# EAGLE schematic GasSensorCentral_v3.0 (EAGLE 7.4.0)
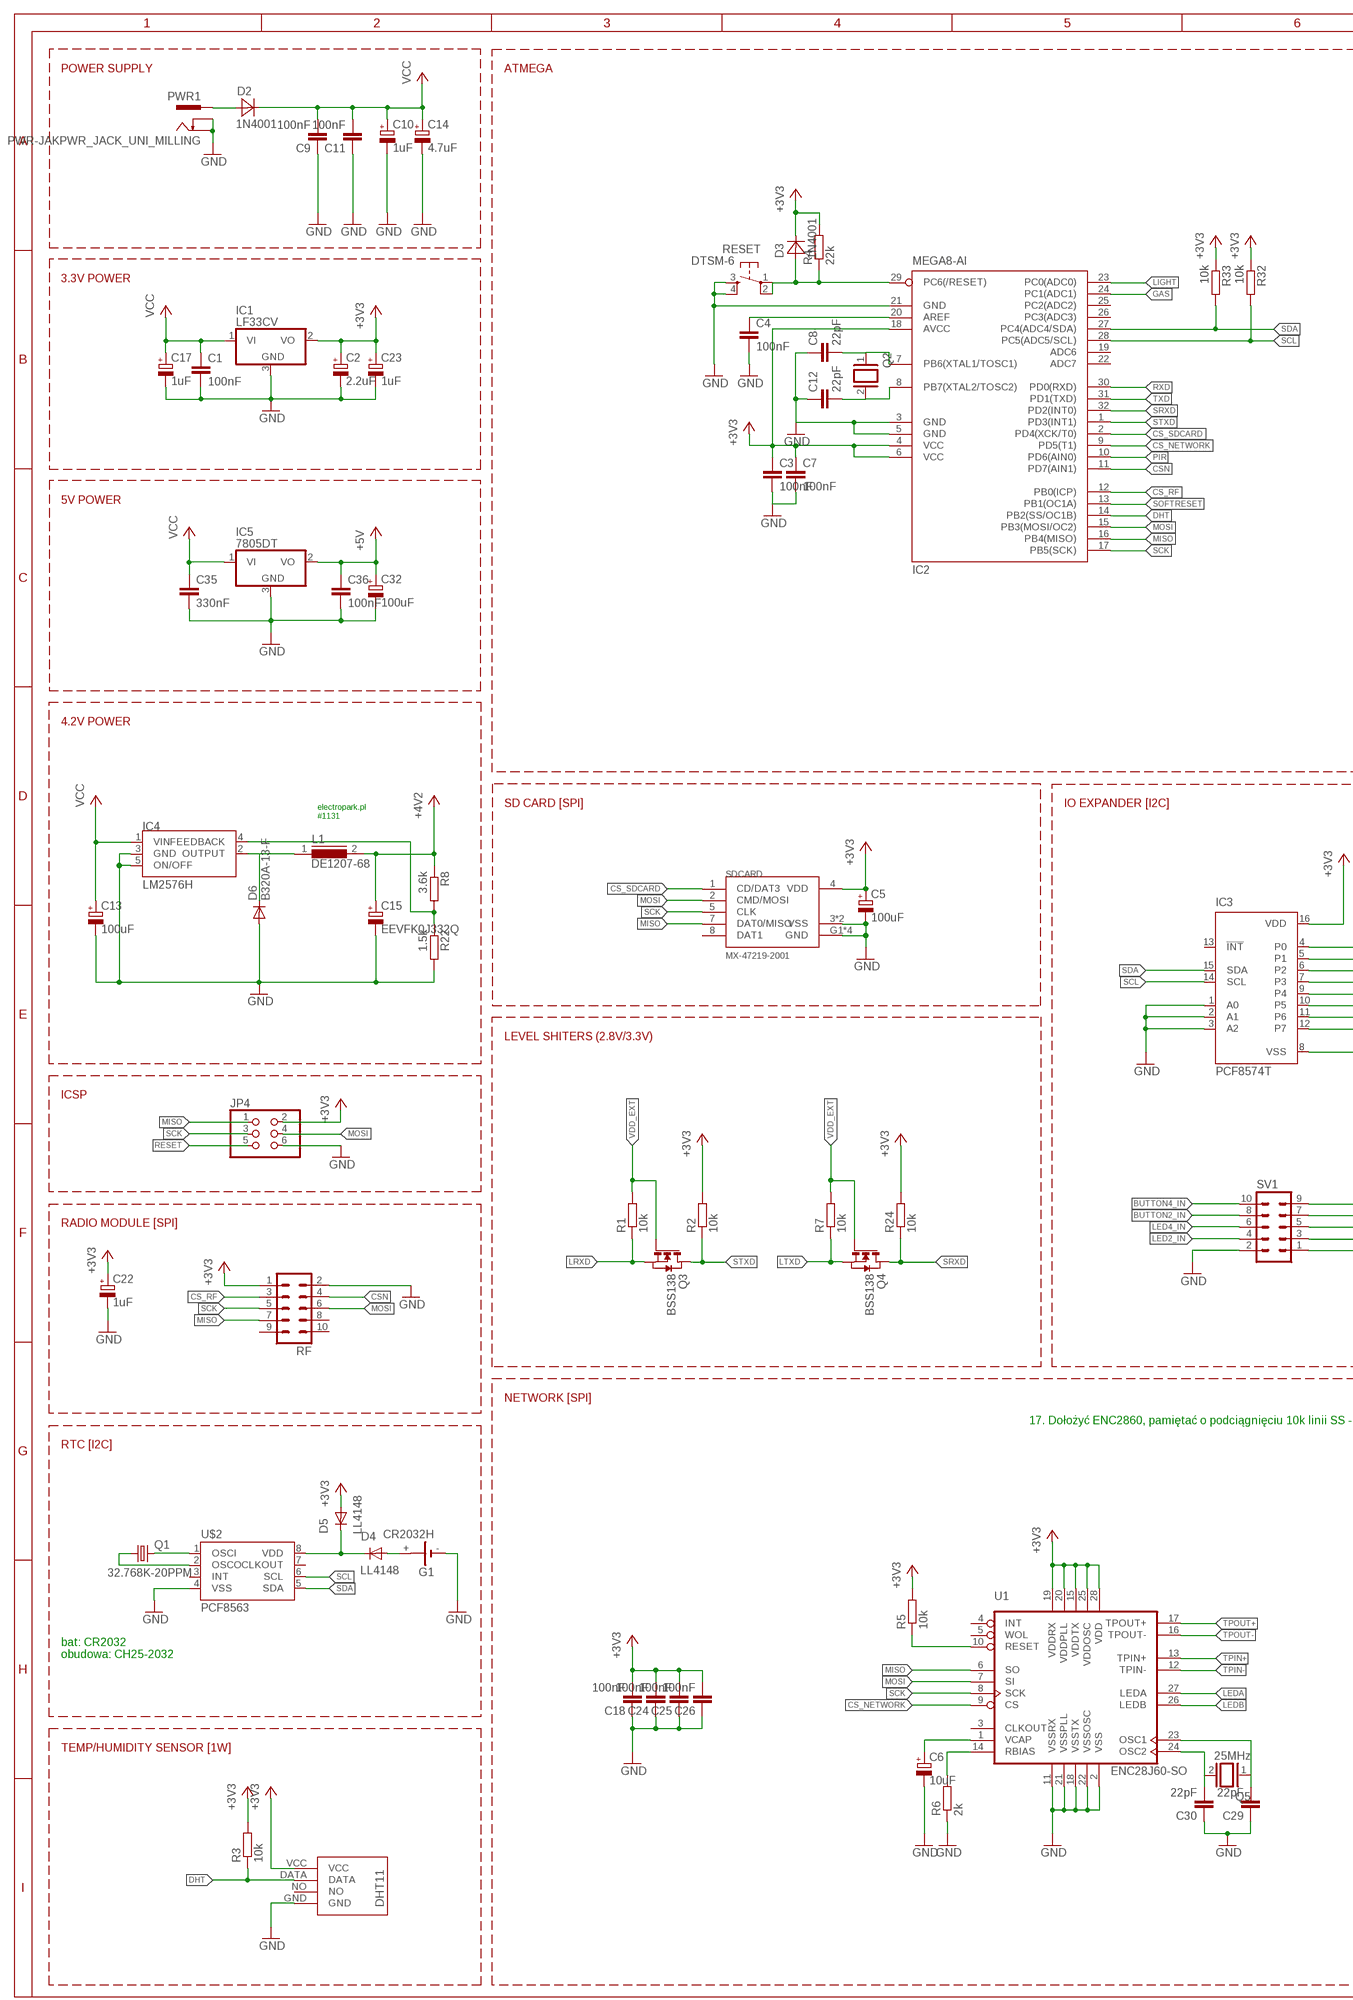
[diagram p0: schematic, sheet 1, part 1 of 2]
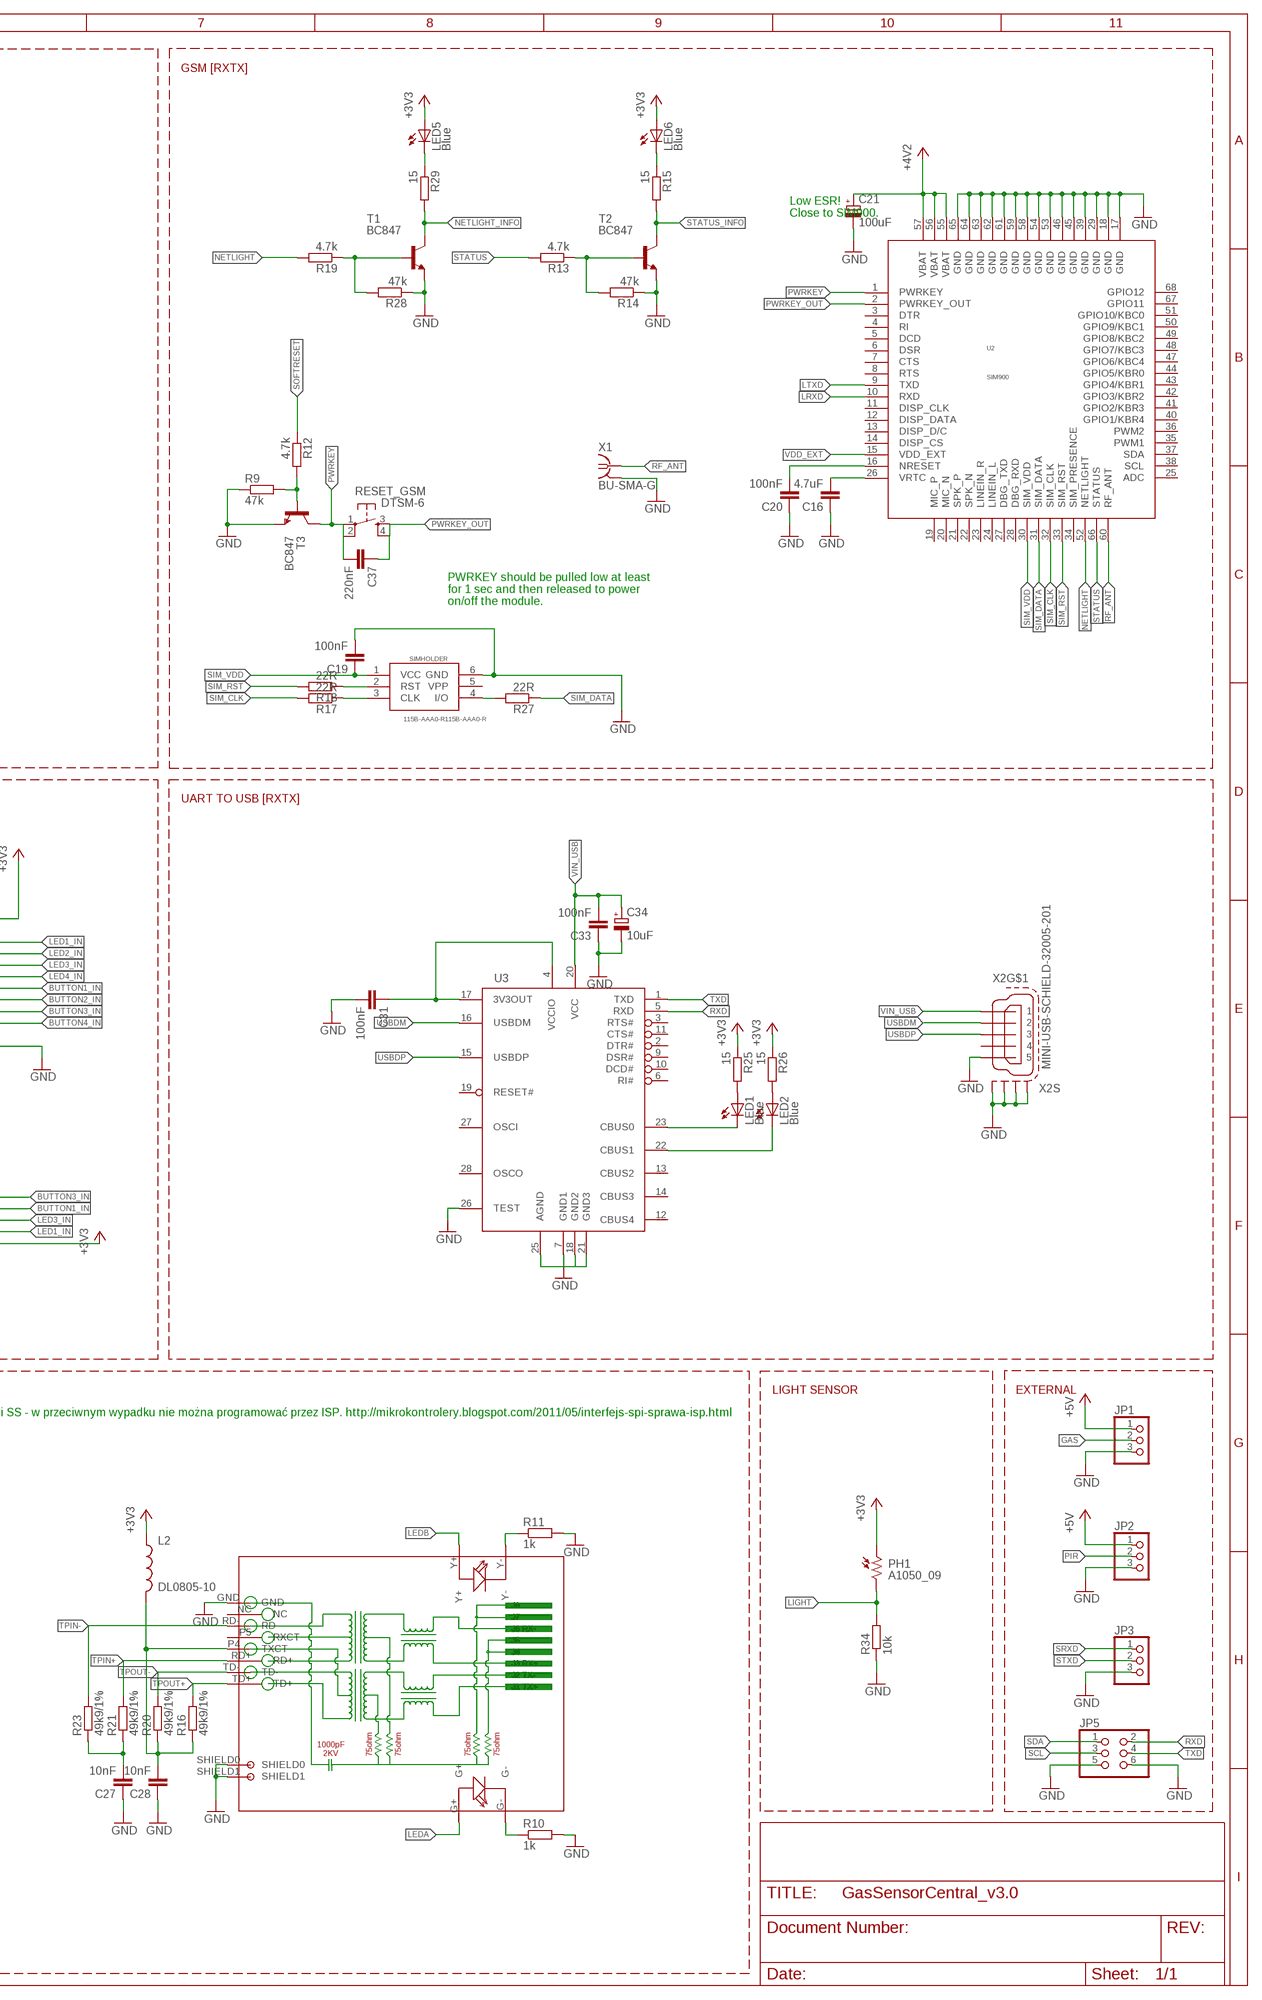
[diagram p1: schematic, sheet 1, part 2 of 2]

## Parts
C1  100nF  C-EUC0805  [C0805]
C2  2.2uF  CPOL-EUB  [PANASONIC_B]
C3  100nF  C-EUC0805  [C0805]
C4  100nF  C-EUC0805  [C0805]
C5  100uF  CPOL-EUB  [PANASONIC_B]
C6  10uF  CPOL-EUB  [PANASONIC_B]
C7  100nF  C-EUC0805  [C0805]
C8  22pF  C-EUC0805  [C0805]
C9  100nF  C-EUC0805  [C0805]
C10  1uF  CPOL-EUB  [PANASONIC_B]
C11  100nF  C-EUC0805  [C0805]
C12  22pF  C-EUC0805  [C0805]
C13  100uF  CPOL-EUB  [PANASONIC_B]
C14  4.7uF  CPOL-EUB  [PANASONIC_B]
C15  EEVFK0J332Q  CPOL-EU  [153CLV-1212]
C16  4.7uF  C-EUC0805  [C0805]
C17  1uF  CPOL-EUB  [PANASONIC_B]
C18  100nF  C-EUC0805  [C0805]
C19  100nF  C-EUC0805  [C0805]
C20  100nF  C-EUC0805  [C0805]
C21  100uF  CPOL-EUB  [PANASONIC_B]
C22  1uF  CPOL-EUB  [PANASONIC_B]
C23  1uF  CPOL-EUB  [PANASONIC_B]
C24  100nF  C-EUC0805  [C0805]
C25  100nF  C-EUC0805  [C0805]
C26  100nF  C-EUC0805  [C0805]
C27  10nF  C-EUC0805  [C0805]
C28  10nF  C-EUC0805  [C0805]
C29  22pF  C-EUC0805  [C0805]
C30  22pF  C-EUC0805  [C0805]
C31  100nF  C-EUC0805  [C0805]
C32  100uF  CPOL-EUB  [PANASONIC_B]
C33  100nF  C-EUC0805  [C0805]
C34  10uF  CPOL-EUB  [PANASONIC_B]
C35  330nF  C-EUC0805  [C0805]
C36  100nF  C-EUC0805  [C0805]
C37  220nF  C-EUC0805  [C0805]
D2  1N4001  MBRA340T3  [SMA]
D3  1N4001  MBRA340T3  [SMA]
D4  LL4148  DIODE-SOD80C  [SOD80C]
D5  LL4148  DIODE-SOD80C  [SOD80C]
D6  B320A-13-F  DIODE-DO214AC  [DO214AC]
G1  CR2032H  [CR2032H]
IC1  LF33CV  78DT  [TO252]
IC2  MEGA8-AI  [TQFP32-08]
IC3  PCF8574T  [SO16W]
IC4  LM2576H  [TO220-52]
IC5  7805DT  [TO252]
JP1  PINHD-1X3  [1X03]
JP2  PINHD-1X3  [1X03]
JP3  PINHD-1X3  [1X03]
JP4  PINHD-2X3  [2X03]
JP5  PINHD-2X3  [2X03]
L1  DE1207-68  DE1207  [DE1207]
L2  DL0805-10  INDUCTOR0805  [0805]
LED1  Blue  LEDSML0805  [SML0805]
LED2  Blue  LEDSML0805  [SML0805]
LED5  Blue  LEDSML0805  [SML0805]
LED6  Blue  LEDSML0805  [SML0805]
PH1  A1050_09  [T0-46-A10XX]
PWR1  PWR-JAKPWR_JACK_UNI_MILLING  [PWR_JACK_UNI_MILLING]
Q1  32.768K-20PPM  CRYSTALTC26V  [TC26V]
Q2  XTAL/S  [QS]
Q3  BSS138  NMOSSOT23  [SOT-23]
Q4  BSS138  NMOSSOT23  [SOT-23]
Q5  25MHz  XTAL/S  [QS]
R1  10k  R-EU_R0805  [R0805]
R2  10k  R-EU_R0805  [R0805]
R3  10k  R-EU_R0805  [R0805]
R4  22k  R-EU_R0805  [R0805]
R5  10k  R-EU_R0805  [R0805]
R6  2k  R-EU_R0805  [R0805]
R7  10k  R-EU_R0805  [R0805]
R8  3.6k  R-EU_R0805  [R0805]
R9  47k  R-EU_R0805  [R0805]
R10  1k  R-EU_R0805  [R0805]
R11  1k  R-EU_R0805  [R0805]
R12  4.7k  R-EU_R0805  [R0805]
R13  4.7k  R-EU_R0805  [R0805]
R14  47k  R-EU_R0805  [R0805]
R15  15  R-EU_R0805  [R0805]
R16  49k9/1%  R-EU_R0805  [R0805]
R17  22R  R-EU_R0805  [R0805]
R18  22R  R-EU_R0805  [R0805]
R19  4.7k  R-EU_R0805  [R0805]
R20  49k9/1%  R-EU_R0805  [R0805]
R21  49k9/1%  R-EU_R0805  [R0805]
R22  1.5k  R-EU_R0805  [R0805]
R23  49k9/1%  R-EU_R0805  [R0805]
R24  10k  R-EU_R0805  [R0805]
R25  15  R-EU_R0805  [R0805]
R26  15  R-EU_R0805  [R0805]
R27  22R  R-EU_R0805  [R0805]
R28  47k  R-EU_R0805  [R0805]
R29  15  R-EU_R0805  [R0805]
R32  10k  R-EU_R0805  [R0805]
R33  10k  R-EU_R0805  [R0805]
R34  10k  R-EU_R0805  [R0805]
RESET  DTSM-6  [DTSM-6]
RESET_GSM  DTSM-6  [DTSM-6]
RF  ML10  [ML10]
RJ1  HR911105A  [HR911105A]
SDCARD  MX-47219-2001  [MX-47219-2001]
SIMHOLDER  115B-AAA0-R115B-AAA0-R  [115B-AAA0-R]
SV1  ML10  [ML10]
T1  BC847  [SOT23]
T2  BC847  [SOT23]
T3  BC847  [SOT23]
U1  ENC28J60-SO  [SO28W]
U2  SIM900  [SIM900]
U3  FT232RL  [SSOP28DB]
U$2  PCF8563  [SO08]
U$3  DHT11-PION.  [DHT11-PION.]
X1  BU-SMA-G  [BU-SMA-G]
X2  MINI-USB-SCHIELD-32005-201  [32005-201]

## Nets
+3V3: C2.+ C3.1 C5.+ C7.1 C18.2 C22.+ C23.+ C24.2 C25.2 C26.2 D3.C D5.A IC1.2(VO) IC2.4(VCC) IC2.6(VCC) IC2.18(AVCC) IC3.16(VDD) JP4.2 L2.1 LED5.A LED6.A PH1.1 R2.2 R3.2 R4.2 R5.2 R24.2 R25.1 R26.1 R32.1 R33.1 RF.1 SDCARD.4(VDD) SV1.1 U1.15(VDDTX) U1.19(VDDRX) U1.20(VDDPLL) U1.25(VDDOSC) U1.28(VDD) U$3.VCC
+4V2: C15.+ C21.+ L1.2 R8.1 U2.55(VBAT) U2.56(VBAT) U2.57(VBAT)
+5V: C32.+ C36.1 IC5.2(VO) JP1.1 JP2.1
BUTTON1_IN: IC3.9(P4) SV1.7
BUTTON2_IN: IC3.10(P5) SV1.8
BUTTON3_IN: IC3.11(P6) SV1.9
BUTTON4_IN: IC3.12(P7) SV1.10
CS_NETWORK: IC2.9(PD5(T1)) U1.9(CS)
CS_RF: IC2.12(PB0(ICP)) RF.3
CS_SDCARD: IC2.2(PD4(XCK/T0)) SDCARD.1(CD/DAT3)
CSN: IC2.11(PD7(AIN1)) RF.4
DHT: IC2.14(PB2(SS/OC1B)) R3.1 U$3.DATA
GAS: IC2.24(PC1(ADC1)) JP1.2
GND: C1.2 C2.- C3.2 C4.2 C5.- C6.- C7.2 C8.1 C9.1 C10.- C11.1 C12.1 C13.- C14.- C15.- C16.1 C17.- C18.1 C19.2 C20.1 C21.- C22.- C23.- C24.1 C25.1 C26.1 C27.1 C28.1 C29.1 C30.1 C31.2 C32.- C33.1 C34.- C35.2 C36.2 G1.- IC1.3(GND) IC2.3(GND) IC2.5(GND) IC2.21(GND) IC3.1(A0) IC3.2(A1) IC3.3(A2) IC3.8(VSS) IC4.3(GND) IC4.5(ON/OFF) IC5.3(GND) JP1.3 JP2.3 JP3.3 JP4.6 JP5.5 JP5.6 PWR1.- PWR1.-1(-) PWR1.-2(-) PWR1.-3(-) PWR1.-4(-) PWR1.-5(-) PWR1.-6(-) PWR1.-- PWR1.--1(--) PWR1.--2(--) PWR1.--3(--) PWR1.--4(--) PWR1.--5(--) PWR1.--6(--) R6.1 R9.1 R10.2 R11.2 R14.1 R22.2 R28.1 R34.1 RESET.3 RESET.4 RF.2 RJ1.GND RJ1.SHIELD0 RJ1.SHIELD1 SDCARD.3(VSS) SDCARD.6(VSS) SDCARD.G1(GND) SDCARD.G2(GND) SDCARD.G3(GND) SDCARD.G4(GND) SIMHOLDER.6(GND) SV1.2 T1.2(E) T2.2(E) T3.2(E) U1.2(VSS) U1.11(VSSRX) U1.18(VSSTX) U1.21(VSSPLL) U1.22(VSSOSC) U2.17(GND) U2.18(GND) U2.29(GND) U2.39(GND) U2.45(GND) U2.46(GND) U2.53(GND) U2.54(GND) U2.58(GND) U2.59(GND) U2.61(GND) U2.62(GND) U2.63(GND) U2.64(GND) U2.65(GND) U3.7(GND1) U3.18(GND2) U3.21(GND3) U3.25(AGND) U3.26(TEST) U$2.4(VSS) U$3.GND X1.2 X1.3 X1.4 X1.5 X2.5 X2.M1(S:S1) X2.M2(S:S2) X2.M3(S:S3) X2.M4(S:S4)
LED1_IN: IC3.4(P0) SV1.3
LED2_IN: IC3.5(P1) SV1.4
LED3_IN: IC3.6(P2) SV1.5
LED4_IN: IC3.7(P3) SV1.6
LEDA: RJ1.G+ U1.27(LEDA)
LEDB: RJ1.Y+ U1.26(LEDB)
LIGHT: IC2.23(PC0(ADC0)) PH1.2 R34.2
LRXD: Q3.2(S) R1.1 U2.10(RXD)
LTXD: Q4.2(S) R7.1 U2.9(TXD)
MISO: IC2.16(PB4(MISO)) JP4.1 RF.7 SDCARD.7(DAT0/MISO) U1.6(SO)
MOSI: IC2.15(PB3(MOSI/OC2)) JP4.4 RF.6 SDCARD.2(CMD/MOSI) U1.7(SI)
N$1: C4.1 IC2.20(AREF)
N$2: Q1.1 U$2.2(OSCO)
N$3: IC4.4(FEEDBACK) R8.2 R22.1
N$4: D2.A PWR1.+ PWR1.+1(+) PWR1.+2(+) PWR1.+3(+) PWR1.+4(+) PWR1.+5(+) PWR1.+6(+)
N$5: D4.C D5.C U$2.8(VDD)
N$6: R27.2 SIMHOLDER.4(I/O)
N$7: LED5.C R29.1
N$8: Q1.2 U$2.1(OSCI)
N$9: R13.1 R14.2 T2.1(B)
N$10: D6.A
N$11: LED6.C R15.1
N$12: D6.C IC4.2(OUTPUT) L1.1
N$13: C20.2 U2.16(NRESET)
N$14: R9.2 R12.2 T3.1(B)
N$15: R19.1 R28.2 T1.1(B)
N$16: D4.A G1.+
N$17: C16.2 U2.26(VRTC)
N$18: R5.1 U1.10(RESET)
N$19: C6.+ U1.1(VCAP)
N$20: R6.2 U1.14(RBIAS)
N$21: R11.1 RJ1.Y-
N$22: R10.1 RJ1.G-
N$23: C29.2 Q5.1 U1.23(OSC1)
N$24: R18.1 SIMHOLDER.2(RST)
N$25: R17.1 SIMHOLDER.3(CLK)
N$26: C30.2 Q5.2 U1.24(OSC2)
N$27: LED1.C U3.23(CBUS0)
N$28: LED2.C U3.22(CBUS1)
N$29: C8.2 IC2.7(PB6(XTAL1/TOSC1)) Q2.1
N$30: C27.2 R21.1 R23.1
N$31: C28.2 L2.2 R16.1 R20.1 RJ1.P4(TXCT)
N$32: LED1.A R25.2
N$33: LED2.A R26.2
N$35: C12.2 IC2.8(PB7(XTAL2/TOSC2)) Q2.2
N$96: C31.1 U3.4(VCCIO) U3.17(3V3OUT)
NETLIGHT: R19.2 U2.52(NETLIGHT)
NETLIGHT_INFO: R29.2 T1.3(C)
PIR: IC2.10(PD6(AIN0)) JP2.2
PWRKEY: C37.2 RESET_GSM.1 RESET_GSM.2 T3.3(C) U2.1(PWRKEY)
PWRKEY_OUT: C37.1 RESET_GSM.3 RESET_GSM.4 U2.2(PWRKEY_OUT)
RESET: D3.A IC2.29(PC6(/RESET)) JP4.5 R4.1 RESET.1 RESET.2
RF_ANT: U2.60(RF_ANT) X1.1
RXD: IC2.30(PD0(RXD)) JP5.2 U3.5(RXD)
SCK: IC2.17(PB5(SCK)) JP4.3 RF.5 SDCARD.5(CLK) U1.8(SCK)
SCL: IC2.28(PC5(ADC5/SCL)) IC3.14(SCL) JP5.3 R32.2 U$2.6(SCL)
SDA: IC2.27(PC4(ADC4/SDA)) IC3.15(SDA) JP5.1 R33.2 U$2.5(SDA)
SIM_CLK: R17.2 U2.32(SIM_CLK)
SIM_DATA: R27.1 U2.31(SIM_DATA)
SIM_RST: R18.2 U2.33(SIM_RST)
SIM_VDD: C19.1 SIMHOLDER.1(VCC) U2.30(SIM_VDD)
SOFTRESET: IC2.13(PB1(OC1A)) R12.1
SRXD: IC2.32(PD2(INT0)) JP3.1 Q4.1(D) R24.1
STATUS: R13.2 U2.66(STATUS)
STATUS_INFO: R15.2 T2.3(C)
STXD: IC2.1(PD3(INT1)) JP3.2 Q3.1(D) R2.1
TPIN+: R21.2 RJ1.RD+ U1.13(TPIN+)
TPIN-: R23.2 RJ1.RD- U1.12(TPIN-)
TPOUT+: R16.2 RJ1.TD+ U1.17(TPOUT+)
TPOUT-: R20.2 RJ1.TD- U1.16(TPOUT-)
TXD: IC2.31(PD1(TXD)) JP5.4 U3.1(TXD)
USBDM: U3.16(USBDM) X2.2
USBDP: U3.15(USBDP) X2.3
VCC: C1.1 C9.2 C10.+ C11.2 C13.+ C14.+ C17.+ C35.1 D2.C IC1.1(VI) IC4.1(VIN) IC5.1(VI)
VDD_EXT: Q3.3(G) Q4.3(G) R1.2 R7.2 U2.15(VDD_EXT)
VIN_USB: C33.2 C34.+ U3.20(VCC) X2.1
Unconnected: IC2.19(ADC6) IC2.22(ADC7) IC2.25(PC2(ADC2)) IC2.26(PC3(ADC3)) IC3.13(!INT) RF.8 RF.9 RF.10 RJ1.NC RJ1.P5(RXCT) SDCARD.8(DAT1) SIMHOLDER.5(VPP) U1.3(CLKOUT) U1.4(INT) U1.5(WOL) U2.3(DTR) U2.4(RI) U2.5(DCD) U2.6(DSR) U2.7(CTS) U2.8(RTS) U2.11(DISP_CLK) U2.12(DISP_DATA) U2.13(DISP_D/C) U2.14(DISP_CS) U2.19(MIC_P) U2.20(MIC_N) U2.21(SPK_P) U2.22(SPK_N) U2.23(LINEIN_R) U2.24(LINEIN_L) U2.25(ADC) U2.27(DBG_TXD) U2.28(DBG_RXD) U2.34(SIM_PRESENCE) U2.35(PWM1) U2.36(PWM2) U2.37(SDA) U2.38(SCL) U2.40(GPIO1/KBR4) U2.41(GPIO2/KBR3) U2.42(GPIO3/KBR2) U2.43(GPIO4/KBR1) U2.44(GPIO5/KBR0) U2.47(GPIO6/KBC4) U2.48(GPIO7/KBC3) U2.49(GPIO8/KBC2) U2.50(GPIO9/KBC1) U2.51(GPIO10/KBC0) U2.67(GPIO11) U2.68(GPIO12) U3.2(DTR#) U3.3(RTS#) U3.6(RI#) U3.9(DSR#) U3.10(DCD#) U3.11(CTS#) U3.12(CBUS4) U3.13(CBUS2) U3.14(CBUS3) U3.19(RESET#) U3.27(OSCI) U3.28(OSCO) U$2.3(INT) U$2.7(CLKOUT) U$3.NO X2.4

## Notes on the sheet
- POWER SUPPLY | ATMEGA | GSM [RXTX]
- Low ESR!
  Close to SIM900.
- 3.3V POWER
- 5V POWER
- PWRKEY should be pulled low at least 
  for 1 sec and then released to power 
  on/off the module.
- 4.2V POWER
- SD CARD [SPI] | IO EXPANDER [I2C] | UART TO USB [RXTX]
- electropark.pl
  #1131
- LEVEL SHITERS (2.8V/3.3V)
- ICSP
- RADIO MODULE [SPI]
- NETWORK [SPI] | LIGHT SENSOR | EXTERNAL
- 17. Dołożyć ENC2860, pamiętać o podciągnięciu 10k linii SS - w przeciwnym wypadku nie można programować przez ISP. http://mikrokontrolery.blogspot.com/2011/05/interfejs-spi-sprawa-isp.html
- RTC [I2C]
- bat: CR2032
  obudowa: CH25-2032
- TEMP/HUMIDITY SENSOR [1W]

## Library data of the parts
C1 C3 C4 C7-C9 C11 C12 C16 C18-C20 C24-C31 C33 C35-C37 = rcl:C-EU: CAPACITOR, European symbol
C2 C5 C6 C10 C13 C14 C17 C21-C23 C32 C34 = rcl:CPOL-EU: POLARIZED CAPACITOR, European symbol
C15 = hosho:CPOL-EU: POLARIZED CAPACITOR, European symbol
D2 D3 = diode:MBRA340T3: Surface Mount Schottky Power Rectifier Source: http://www.onsemi.com/pub_link/Collateral/MBRA340T3-D.PDF
D4-D6 = diode:DIODE-: DIODE
G1 = hosho:CR2032H: LI BATTERY Varta
IC1 = hosho:78*: Positive VOLTAGE REGULATOR Source: http://cache.national.com/ds/LM/LM78L05.pdf http://www.fairchildsemi.com/ds/LM/LM7805.pdf
IC2 = atmel:MEGA8: MICROCONTROLLER 8 Kbytes FLASH, 1 kbytes SRAM, 512 bytes EEPROM, USART, 6-channel 10 bit ADC, 2-channel 8 bit ADC Pin compatible with Atmega48, ATMega88, ATMega168 Source: avr.lbr; MPN: ATMEGA8-16AU; OC_FARNELL: 9171371; OC_NEWARK: 73M8863
IC3 = micro-philips:PCF8574: I2C-Bus Remote 8-bit I/O expander http://www.semiconductors.philips.com/acrobat_download/datasheets/PCF8574_4.pdf; MPN: PCF8574T/3,512; OC_FARNELL: 1201255; OC_NEWARK: 70R6870
IC4 = hosho:LM2576H
IC5 = linear:78*: Positive VOLTAGE REGULATOR Source: http://cache.national.com/ds/LM/LM78L05.pdf http://www.fairchildsemi.com/ds/LM/LM7805.pdf
JP1-JP3 = pinhead:PINHD-1X3: PIN HEADER
JP4 JP5 = pinhead:PINHD-2X3: PIN HEADER
L1 = hosho:DE1207: High Power Density, High Efficiency, Shielded Inductors Source: coiltronics_dr_series.pdf
L2 = hosho:INDUCTOR: Inductors Basic Inductor/Choke - 0603 and 1206. Footprints are not proven and vary greatly between part numbers. SRN6045- 33uH, 20% 1.4A SDR0403-560KL - 56uH, 10%, 500mA RMS/740mA peak
LED1 LED2 LED5 LED6 = led:LED: LED OSRAM: - CHIPLED LG R971, LG N971, LY N971, LG Q971, LY Q971, LO R971, LY R971 LH N974, LH R974 LS Q976, LO Q976, LY Q976 LO Q996 - Hyper CHIPLED LW Q18S LB Q993, LB Q99A, LB R99A - SideLED LS A670, LO A670, LY A670, LG A670, LP A670 LB A673, LV A673, LT A673, LW A673 LH A674 LY A675 LS A676, LA A676, LO A676, LY A676, LW A676 LS A679, LY A679, LG A679 - Hyper Micro SIDELED® LS Y876, LA Y876, LO Y876, LY Y876 LT Y87S - SmartLED LW L88C, LW L88S LB L89C, LB L89S, LG L890 LS L89K, LO L89K, LY L89K LS L896, LA L896, LO L896, LY L896 - TOPLED LS T670, LO T670, LY T670, LG T670, LP T670 LSG T670, LSP T670, LSY T670, LOP T670, LYG T670 LG T671, LOG T671, LSG T671 LB T673, LV T673, LT T673, LW T673 LH T674 LS T676, LA T676, LO T676, LY T676, LB T676, LH T676, LSB T676, LW T676 LB T67C, LV T67C, LT T67C, LS T67K, LO T67K, LY T67K, LW E67C LS E67B, LA E67B, LO E67B, LY E67B, LB E67C, LV E67C, LT E67C LW T67C LS T679, LY T679, LG T679 LS T770, LO T770, LY T770, LG T770, LP T770 LB T773, LV T773, LT T773, LW T773 LH T774 LS E675, LA E675, LY E675, LS T675 LS T776, LA T776, LO T776, LY T776, LB T776 LHGB T686 LT T68C, LB T68C - Hyper Mini TOPLED® LB M676 - Mini TOPLED Santana® LG M470 LS M47K, LO M47K, LY M47K Source: http://www.osram.convergy.de LUXEON: - LUMILED® LXK2-PW12-R00, LXK2-PW12-S00, LXK2-PW14-U00, LXK2-PW14-V00 LXK2-PM12-R00, LXK2-PM12-S00, LXK2-PM14-U00 LXK2-PE12-Q00, LXK2-PE12-R00, LXK2-PE12-S00, LXK2-PE14-T00, LXK2-PE14-U00 LXK2-PB12-K00, LXK2-PB12-L00, LXK2-PB12-M00, LXK2-PB14-N00, LXK2-PB14-P00, LXK2-PB14-Q00 LXK2-PR12-L00, LXK2-PR12-M00, LXK2-PR14-Q00, LXK2-PR14-R00 LXK2-PD12-Q00, LXK2-PD12-R00, LXK2-PD12-S00 LXK2-PH12-R00, LXK2-PH12-S00 LXK2-PL12-P00, LXK2-PL12-Q00, LXK2-PL12-R00 Source: www.luxeon.com KINGBRIGHT: KA-3528ASYC Source: www.kingbright.com
PH1 = photo-elements:A10: Sensor Robust Light Sensing Applications Outdoor Light Sensing Application Source: http://optoelectronics.perkinelmer.com/content/Datasheets/DTS_PhotocellsA1050.pdf
PWR1 = hosho:PWR-JAK
Q1 = crystal:CRYSTAL: CRYSTAL; OC_FARNELL: unknown; OC_NEWARK: unknown
Q2 Q5 = special:XTAL/S: CRYSTAL
Q3 Q4 = zetex:NMOSSOT23: MOS FET; OC_FARNELL: unknown; OC_NEWARK: unknown
R1-R29 R32-R34 = rcl:R-EU_: RESISTOR, European symbol
RESET RESET_GSM = hosho:DTSM-6
RF SV1 = con-harting-ml:ML10: HARTING; OC_FARNELL: unknown; OC_NEWARK: unknown
RJ1 = hosho:HR911105A
SDCARD = hosho:MX-47219-2001
SIMHOLDER = hosho:115B-AAA0-R
T1-T3 = transistor:BC847: NPN TRANSISTOR
U1 = hosho:ENC28J60-*: Microchip 10Mbit Eth. contoller with SPI interface
U2 = ICs_v54:SIM900
U3 = ftdichip-5:FT232RL: USB UART 4th Generation USB UART (USB <-> Serial) Controller
U$2 = hosho:PCF8563
U$3 = DHT11:DHT11-PION.: DHT11 Czujnik temperatury i wilgotności (widok pionowy)
X1 = hosho:BU-SMA-G: FEMALE SMA CONNECTOR Radiall distributor RS 193-9117; OC_FARNELL: unknown; OC_NEWARK: unknown
X2 = con-cypressindustries:MINI-USB-SCHIELD-: MINI USB-B Conector Source: www.cypressindustries.com; OC_FARNELL: unknown; OC_NEWARK: unknown